# Altium schematic sheet total_project.SchDoc: MCU
size A4; SheetNumber: 1; SheetTotal: 1
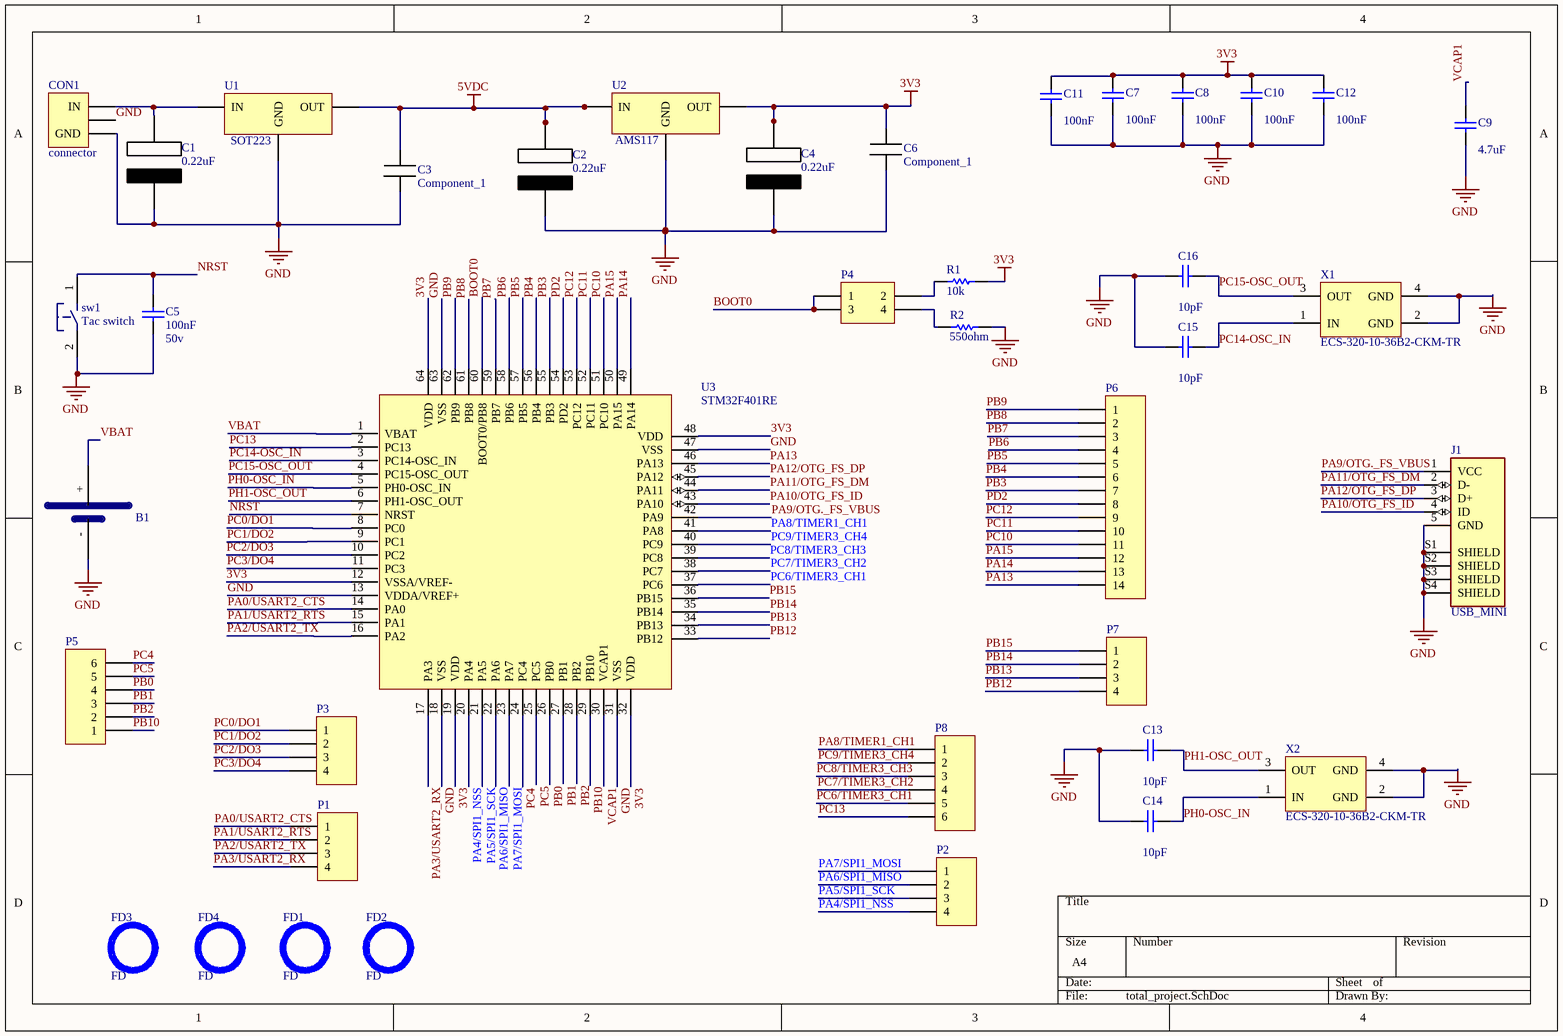
[diagram p0: total_project.SchDoc]

## Parts
B1  Littium Battery  [MY_Battery]  (value not drawn)
C1  0.22uF  [CAPCP3216X16N]
C2  0.22uF  [CAPCP3216X16N]
C3  Component_1  [CAPCP2407X01N]
C4  0.22uF  [CAPCP3216X16N]
C5  Volte: 50v  [MY_0603]  (hidden comment: 100nF)
C6  Component_1  [CAPCP2407X01N]
C7  value 100nF  [1608[0603]cap]  (hidden comment: Cap Semi_1)
C8  value 100nF  [1608[0603]cap]  (hidden comment: Cap Semi_1)
C9  value 4.7uF  [1608[0603]cap]  (hidden comment: Cap Semi_1)
C10  value 100nF  [1608[0603]cap]  (hidden comment: Cap Semi_1)
C11  value 100nF  [1608[0603]cap]  (hidden comment: Cap Semi_1)
C12  value 100nF  [1608[0603]cap]  (hidden comment: Cap Semi_1)
C13  value 10pF  [0402cap]  (hidden comment: Cap Semi_4)
C14  value 10pF  [0402cap]  (hidden comment: Cap Semi_4)
C15  value 10pF  [0402cap]  (hidden comment: Cap Semi_4)
C16  value 10pF  [0402cap]  (hidden comment: Cap Semi_4)
CON1  connector  [connector]
FD1  FD  [FD]
FD2  FD  [FD]
FD3  FD  [FD]
FD4  FD  [FD]
J1  USB_MINI  [EDAC_690-005-299-043]
P1  Header 4  [My_1X04]  (value not drawn)
P2  Header 4  [My_1X04]  (value not drawn)
P3  Header 4  [My_1X04]  (value not drawn)
P4  Header 2X2  [My_2X02]  (value not drawn)
P5  Header 6  [My_1X06]  (value not drawn)
P6  Header 14  [My_1X14]  (value not drawn)
P7  Header 4  [My_1X04]  (value not drawn)
P8  Header 6  [My_1X06]  (value not drawn)
R1  10k  [MY_0805]
R2  550ohm  [MY_0805]
sw1  Tac switch  [MY_TACTILE-PTH]
U1  SOT223  [PCBComponent_1]
U2  AMS117  [DPAK230P700X170-4N]
U3  STM32F401RE  [CQFP50P1200X1200X160-64N]
X1  ECS-320-10-36B2-CKM-TR  [ECS-320-10-36B2-CKM-TR]
X2  ECS-320-10-36B2-CKM-TR  [ECS-320-10-36B2-CKM-TR]

## Nets
3V3: C4.2 C6.2 C7.2 C8.2 C10.2 C11.2 C12.2 R1.2 U2.2(OUT) U3.12(VSSA/VREF-) U3.19(VDD) U3.32(VDD) U3.48(VDD) U3.64(VDD)
5VDC: C2.2 C3.2 U1.3(OUT) U2.3(IN)
GND: B1.- C1.1 C2.1 C3.1 C4.1 C5.1 C6.1 C7.1 C8.1 C9.2 C10.1 C11.1 C12.1 C13.1 C14.1 C15.1 C16.1 CON1.2(GND) CON1.3(GND) J1.5(GND) J1.S1(SHIELD) J1.S2(SHIELD) J1.S3(SHIELD) J1.S4(SHIELD) R2.2 sw1.2 U1.2(GND) U2.1(GND) U3.13(VDDA/VREF+) U3.18(VSS) U3.31(VSS) U3.47(VSS) U3.63(VSS) X1.2(GND) X1.4(GND) X2.2(GND) X2.4(GND)
BOOT0: P4.1 P4.3 U3.60(BOOT0/PB8)
NRST: C5.2 sw1.1 U3.7(NRST)
PA0/USART2_CTS: P1.1 U3.14(PA0)
PA1/USART2_RTS: P1.2 U3.15(PA1)
PA2/USART2_TX: P1.3 U3.16(PA2)
PA3/USART2_RX: P1.4 U3.17(PA3)
PA4/SPI1_NSS: P2.4 U3.20(PA4)
PA5/SPI1_SCK: P2.3 U3.21(PA5)
PA6/SPI1_MISO: P2.2 U3.22(PA6)
PA7/SPI1_MOSI: P2.1 U3.23(PA7)
PA8/TIMER1_CH1: P8.1 U3.41(PA8)
PA9/OTG._FS_VBUS: J1.1(VCC) U3.42(PA9)
PA10/OTG_FS_ID: J1.4(ID) U3.43(PA10)
PA11/OTG_FS_DM: J1.2(D-) U3.44(PA11)
PA12/OTG_FS_DP: J1.3(D+) U3.45(PA12)
PA13: P6.14 U3.46(PA13)
PA14: P6.13 U3.49(PA14)
PA15: P6.12 U3.50(PA15)
PB0: P5.4 U3.26(PB0)
PB1: P5.3 U3.27(PB1)
PB2: P5.2 U3.28(PB2)
PB3: P6.7 U3.55(PB3)
PB4: P6.6 U3.56(PB4)
PB5: P6.5 U3.57(PB5)
PB6: P6.4 U3.58(PB6)
PB7: P6.3 U3.59(PB7)
PB8: P6.2 U3.61(PB8)
PB9: P6.1 U3.62(PB9)
PB10: P5.1 U3.29(PB10)
PB12: P7.4 U3.33(PB12)
PB13: P7.3 U3.34(PB13)
PB14: P7.2 U3.35(PB14)
PB15: P7.1 U3.36(PB15)
PC0/DO1: P3.1 U3.8(PC0)
PC1/DO2: P3.2 U3.9(PC1)
PC2/DO3: P3.3 U3.10(PC2)
PC3/DO4: P3.4 U3.11(PC3)
PC4: P5.6 U3.24(PC4)
PC5: P5.5 U3.25(PC5)
PC6/TIMER3_CH1: P8.5 U3.37(PC6)
PC7/TIMER3_CH2: P8.4 U3.38(PC7)
PC8/TIMER3_CH3: P8.3 U3.39(PC8)
PC9/TIMER3_CH4: P8.2 U3.40(PC9)
PC10: P6.11 U3.51(PC10)
PC11: P6.10 U3.52(PC11)
PC12: P6.9 U3.53(PC12)
PC13: P8.6 U3.2(PC13)
PC14-OSC_IN: C15.2 U3.3(PC14-OSC_IN) X1.1(IN)
PC15-OSC_OUT: C16.2 U3.4(PC15-OSC_OUT) X1.3(OUT)
PD2: P6.8 U3.54(PD2)
PH0-OSC_IN: C14.2 U3.5(PH0-OSC_IN) X2.1(IN)
PH1-OSC_OUT: C13.2 U3.6(PH1-OSC_OUT) X2.3(OUT)
VBAT: B1.+ U3.1(VBAT)
VCAP1: C9.1 U3.30(VCAP1)
NetC1_2: C1.2 CON1.1(IN) U1.1(IN)
NetP4_2: P4.2 R1.1
NetP4_4: P4.4 R2.1

## Library data of the parts
B1 = Battery: 3V PC Littium Battery; ASiD Part Number: B-AS
C1 C2 C4 = Capasitor
C5 = Cap ceramic: None polar capacitor; ASiD Part Number: C-AS; Value: 100nF
C7 C8 C10-C12 = Cap Semi_1: Capacitor (Semiconductor SIM Model); Published: 8-Jun-2000; LatestRevisionDate: 29-May-2009; LatestRevisionNote: IPC-7351 Footprint Added.; PackageReference: C1206; Publisher: Altium Limited; PackageDescription: Chip Capacitor
C9 = Cap Semi_1_1: Capacitor (Semiconductor SIM Model); Published: 8-Jun-2000; LatestRevisionDate: 29-May-2009; LatestRevisionNote: IPC-7351 Footprint Added.; PackageReference: C1206; Publisher: Altium Limited; PackageDescription: Chip Capacitor
C13-C16 = Cap Semi_4: Capacitor (Semiconductor SIM Model); Published: 8-Jun-2000; LatestRevisionDate: 29-May-2009; LatestRevisionNote: IPC-7351 Footprint Added.; PackageReference: C1206; Publisher: Altium Limited; PackageDescription: Chip Capacitor
J1 = 690-005-299-043: USB - mini B USB 2.0 Receptacle Connector 5 Position Surface Mount, Right Angle; MF: EDAC Inc.; Price: None; Purchase-URL: https://pricing.snapeda.com/search/part/690-005-299-043/?ref=eda; Check_prices: https://www.snapeda.com/parts/690-005-299-043/EDAC%20Inc./view-part/347309/?ref=eda; Value: *; SnapEDA_Link: https://www.snapeda.com/parts/690-005-299-043/EDAC%20Inc./view-part/347309/?ref=snap; Availability: Good; MP: 690-005-299-043; Package: None
P1-P3 P7 = Header 4: Header, 4-Pin; ASiD Part Number: Header 4-AS
P4 = Header 2X2: Header, 2-Pin, Dual row; ASiD Part Number: Header 2X2-AS
P5 P8 = Header 6: Header, 6-Pin; ASiD Part Number: Header 6-AS
P6 = Header 14: Header, 14-Pin; ASiD Part Number: Header 14-AS
R1 R2 = Res: Standard resistor; ASiD Part Number: Res-AS
  R1: Value: 10k
  R2: Value: 550ohm
sw1 = Tac switch: small tac switch; ASiD Part Number: Tac switch-AS
U1 = LM340
U2 = AMS1117